# EasyEDA schematic ESP-01s board to PZEM-004.json
TITLE: x1 PZEM (ESP-01S + LCD2004); REV: 1.1; Date: 2020-07-18; Sheet: 1/1; Drawn By: TrDA; Company: WPM control boards
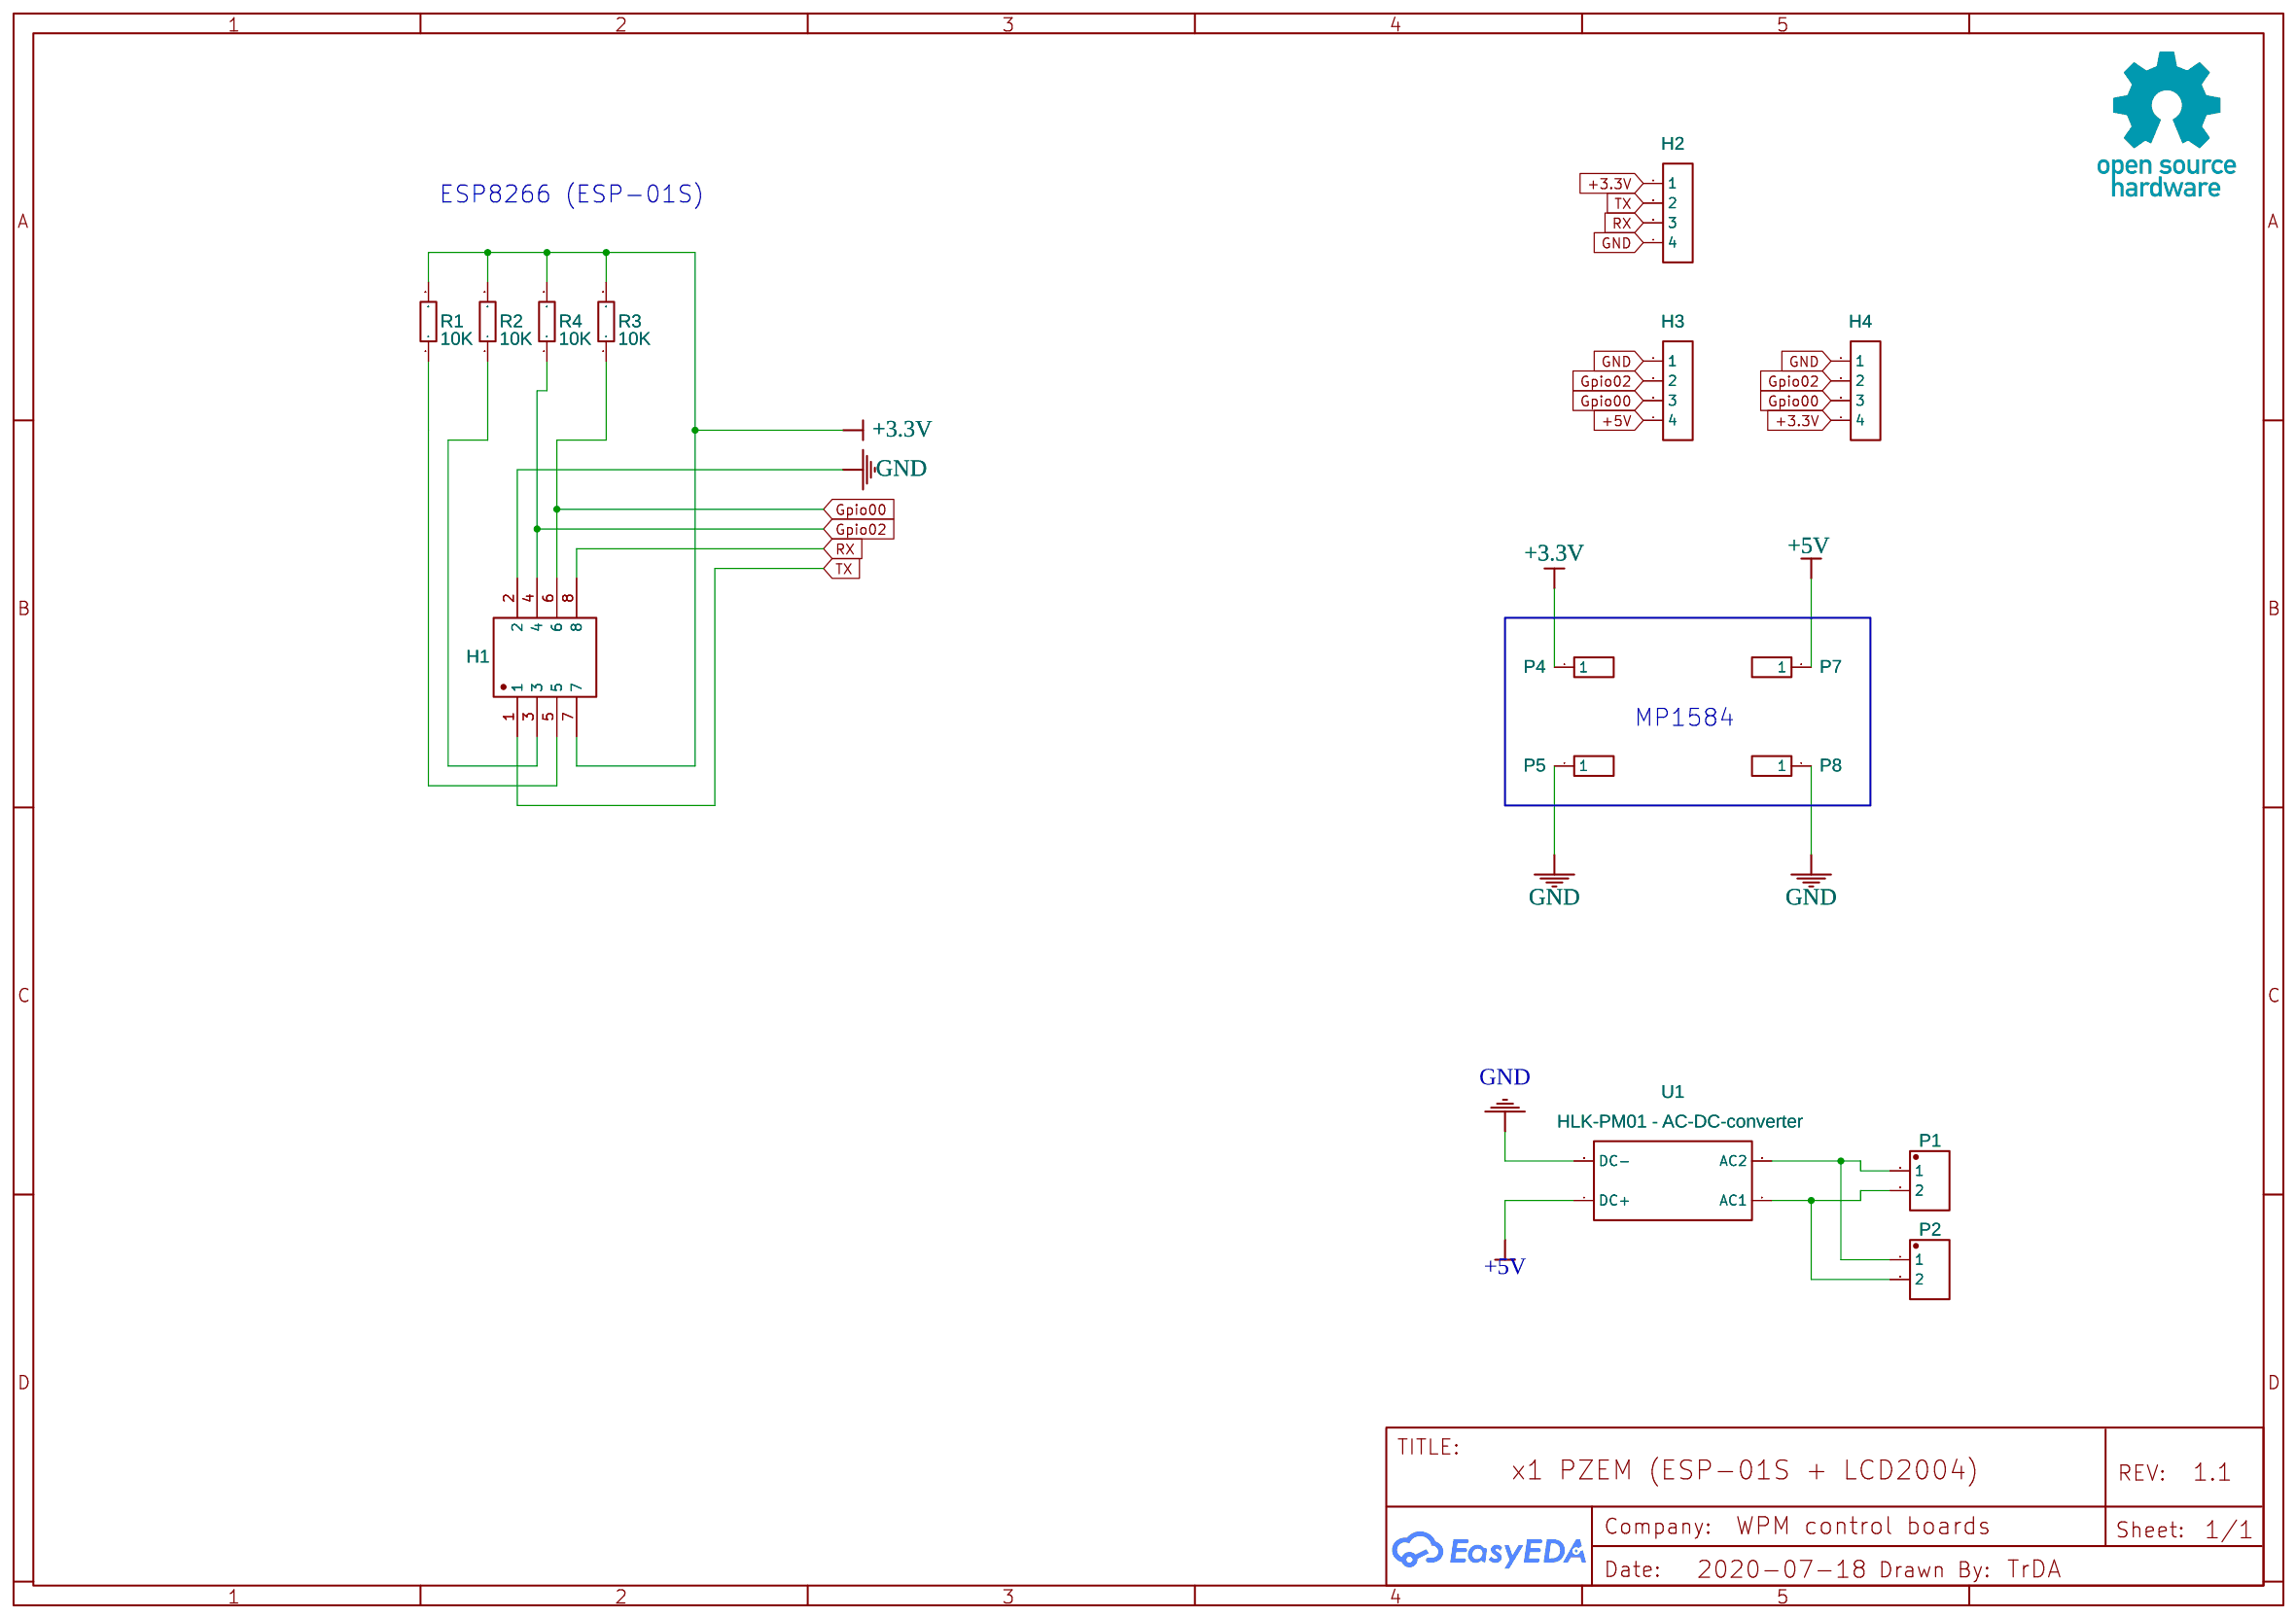
[diagram p0: schematic sheet]

## Parts
H1  210S-2*4P L=11.6MMGold-plated black  [210S-2.54-2X4P]
H2  B4B-XH-AM_(LF)(SN)  [B4B-XH-AM (LF)(SN)]
H3  B4B-XH-AM_(LF)(SN)  [B4B-XH-AM (LF)(SN)]
H4  B4B-XH-AM_(LF)(SN)  [B4B-XH-AM (LF)(SN)]
P1  WJ2EDGVC-5.08-2P  [WJ2EDGVC-5.08-2P]
P2  WJ2EDGVC-5.08-2P  [WJ2EDGVC-5.08-2P]
P4  Header-Male-2.54_1x1  [HDR-1X1/2.54]
P5  Header-Male-2.54_1x1  [HDR-1X1/2.54]
P7  Header-Male-2.54_1x1  [HDR-1X1/2.54]
P8  Header-Male-2.54_1x1  [HDR-1X1/2.54]
R1  10K  [R0805]
R2  10K  [R0805]
R3  10K  [R0805]
R4  10K  [R0805]
U1  HLK-PM01 - AC-DC-converter  [HLK-PW01 3W]

## Library data of the parts
H1 = 210S-2*4P L=11.6MMGold-plated black: Supplier: LCSC; Manufacturer: Ckmtw; Contributor: LCSC; Supplier Part: C124386
H2-H4 = B4B-XH-AM_(LF)(SN): Supplier: LCSC; Supplier Part: C161872; Manufacturer: JST Sales America; Contributor: raptoravril
P1 P2 = WJ2EDGVC-5.08-2P: Supplier: LCSC; Manufacturer: ReliaPro; image: //image.lceda.cn/szlcsc/C8445.jpg; Supplier Part: C8445
P4 P5 P7 P8 = Header-Male-2.54_1x1: Supplier: LCSC; Manufacturer: ReliaPro; Supplier Part: C81276
R1-R4 = RT0805DRD0710KL: Supplier: LCSC; Supplier Part: C165963; Manufacturer: YAGEO; Contributor: LCSC
U1 = HLK-PM01 - AC-DC-converter: Contributor: Elle_10

## Nets
+3.3V: H1.7 H2.1 H4.4 P4.1 R1.2 R2.2 R3.2 R4.2
+5V: H3.4 P7.1 U1.4(DC+)
GND: H1.2 H2.4 H3.1 H4.1 P5.1 P8.1 U1.3(DC-)
Gpio00: H1.6 H3.3 H4.3 R3.1
Gpio02: H1.4 H3.2 H4.2 R4.1
RX: H1.8 H2.3
TX: H1.1 H2.2
Net-(H1-3): H1.3 R2.1
Net-(H1-5): H1.5 R1.1
Net-(P1-1): P1.1 P2.1 U1.2(AC2)
Net-(P1-2): P1.2 P2.2 U1.1(AC1)

## Notes on the sheet
- ESP8266 (ESP-01S)
- MP1584
